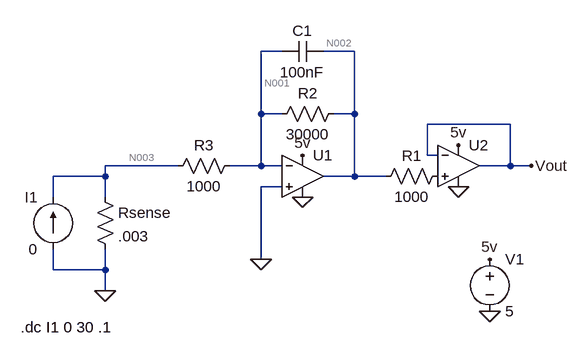
[diagram p0: schematic Draft1.asc]
Draft1.asc, the LTspice schematic file:
Version 4
SHEET 1 880 680
WIRE 96 -112 64 -112
WIRE 208 -112 160 -112
WIRE 64 -16 64 -112
WIRE 96 -16 64 -16
WIRE 208 -16 208 -112
WIRE 208 -16 176 -16
WIRE 448 0 320 0
WIRE 320 48 320 0
WIRE 336 48 320 48
WIRE -64 64 -176 64
WIRE 64 64 64 -16
WIRE 64 64 16 64
WIRE 96 64 64 64
WIRE 448 64 448 0
WIRE 448 64 400 64
WIRE 480 64 448 64
WIRE -176 80 -176 64
WIRE -176 80 -256 80
WIRE 208 80 208 -16
WIRE 208 80 160 80
WIRE 256 80 208 80
WIRE 96 96 64 96
WIRE -256 112 -256 80
WIRE -176 112 -176 80
WIRE 64 208 64 96
WIRE -256 224 -256 192
WIRE -176 224 -176 192
WIRE -176 224 -256 224
WIRE -176 256 -176 224
FLAG 64 208 0
FLAG 480 64 Vout
FLAG -176 256 0
FLAG 416 288 0
FLAG 416 208 5v
FLAG 368 32 5v
FLAG 128 48 5v
FLAG 128 112 0
FLAG 368 96 0
SYMBOL Opamps\\UniversalOpamp2 128 80 R0
SYMATTR InstName U1
SYMBOL Opamps\\UniversalOpamp2 368 64 R0
SYMATTR InstName U2
SYMBOL res 352 64 R90
WINDOW 0 0 56 VBottom 2
WINDOW 3 32 56 VTop 2
SYMATTR InstName R1
SYMATTR Value 1000
SYMBOL res 192 -32 R90
WINDOW 0 0 56 VBottom 2
WINDOW 3 32 56 VTop 2
SYMATTR InstName R2
SYMATTR Value 30000
SYMBOL res -192 96 R0
SYMATTR InstName Rsense
SYMATTR Value .003
SYMBOL res 32 48 R90
WINDOW 0 0 56 VBottom 2
WINDOW 3 32 56 VTop 2
SYMATTR InstName R3
SYMATTR Value 1000
SYMBOL cap 160 -128 R90
WINDOW 0 0 32 VBottom 2
WINDOW 3 32 32 VTop 2
SYMATTR InstName C1
SYMATTR Value 100nF
SYMBOL voltage 416 192 R0
WINDOW 123 0 0 Left 0
WINDOW 39 0 0 Left 0
SYMATTR InstName V1
SYMATTR Value 5
SYMBOL current -256 192 R180
WINDOW 0 24 80 Left 2
WINDOW 3 24 0 Left 2
SYMATTR InstName I1
SYMATTR Value 0
TEXT -306 312 Left 2 !.dc I1 0 30 .1

The netlist it stands for:
* Draft1.asc
XU1 0 N001 5v 0 N002 level.2 Avol=1Meg GBW=10Meg Slew=10Meg ilimit=25m rail=0 Vos=0 phimargin=45 en=0 enk=0 in=0 ink=0 Rin=500Meg  ; pins IN+ IN- V+ V- OUT
XU2 P001 Vout 5v 0 Vout level.2 Avol=1Meg GBW=10Meg Slew=10Meg ilimit=25m rail=0 Vos=0 phimargin=45 en=0 enk=0 in=0 ink=0 Rin=500Meg  ; pins IN+ IN- V+ V- OUT
R1 P001 N002 1000
R2 N002 N001 30000
Rsense N003 0 .003
R3 N001 N003 1000
C1 N002 N001 100nF
V1 5v 0 5
I1 0 N003 0
.dc I1 0 30 .1
.lib UniversalOpamps2.sub
.backanno
.end

* Results of the author's LTspice run, read from the files saved beside the schematic
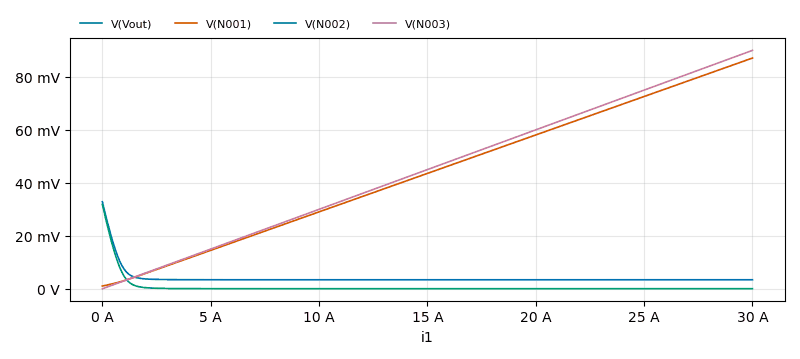
[diagram p1: DC transfer characteristic of Draft1.asc, plotted from the saved traces]
* DC transfer characteristic, 1 run:
*   V(Vout): 32.88 mV at i1=0 A, 3.413 mV at i1=30 A, min 3.403 mV, max 32.88 mV
*   V(N001): 1.033 mV at i1=0 A, 87.1 mV at i1=30 A, min 1.033 mV, max 87.1 mV
*   V(N002): 31.88 mV at i1=0 A, 41.79 µV at i1=30 A, min 28.74 µV, max 31.88 mV
*   V(N003): 3.099 nV at i1=0 A, 90 mV at i1=30 A, min 3.099 nV, max 90 mV